# EAGLE schematic Gamebadge3_revB (EAGLE 8.7.1)
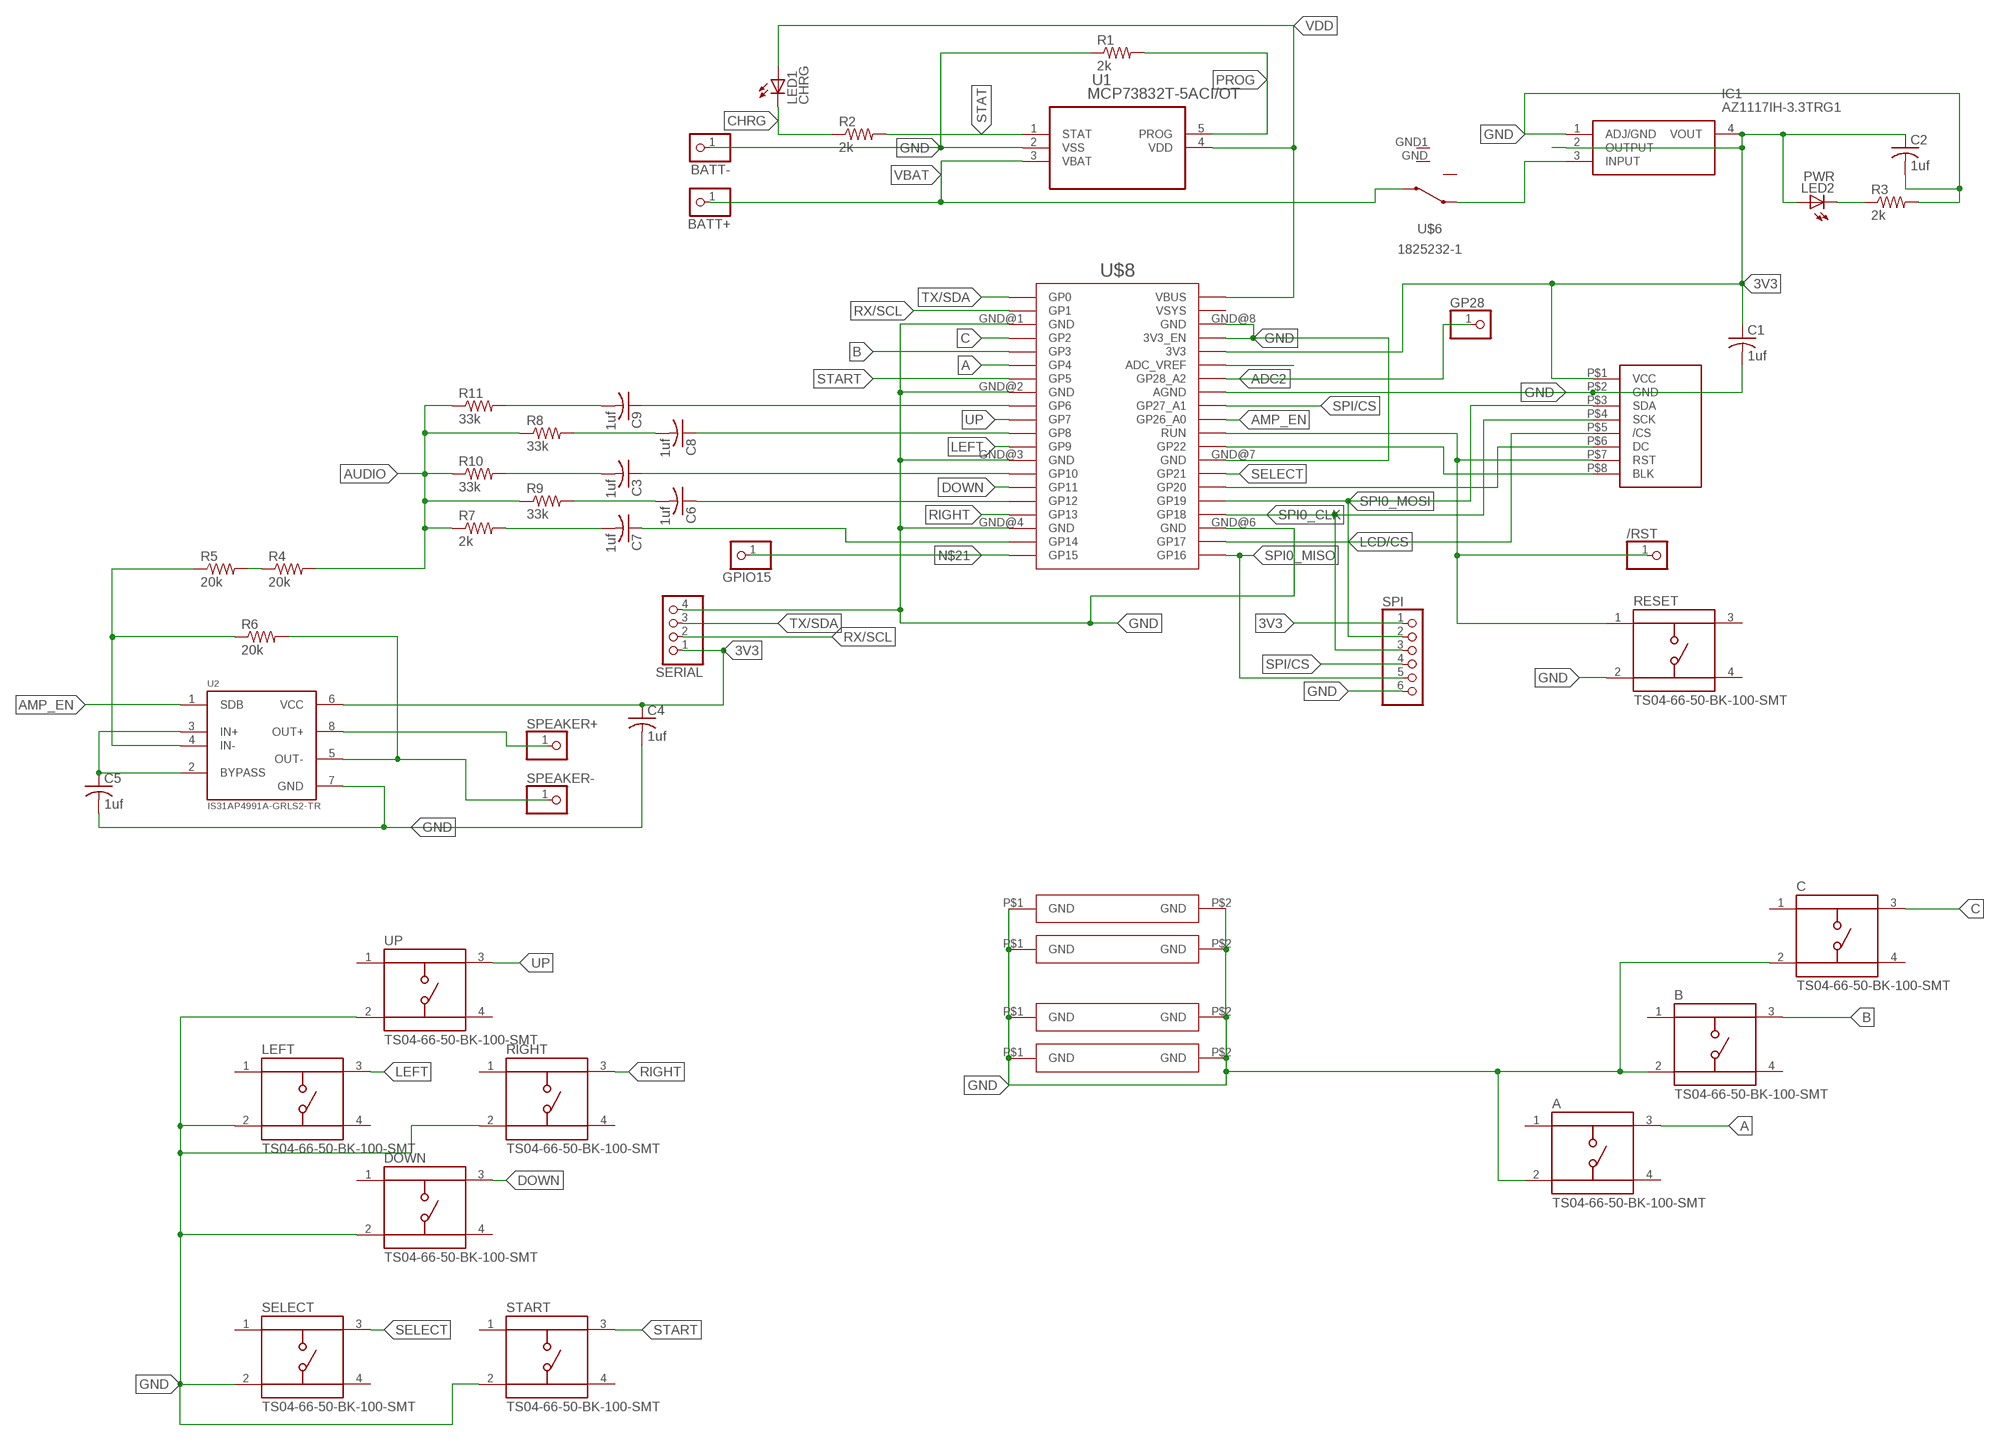
[diagram p0: schematic, sheet 1]

## Parts
/RST  PINHD-1X1  [1X01]
A  TS04-66-50-BK-100-SMT  [SW_TS04-66-50-BK-100-SMT]
B  TS04-66-50-BK-100-SMT  [SW_TS04-66-50-BK-100-SMT]
BATT+  PINHD-1X1  [1X01]
BATT-  PINHD-1X1  [1X01]
C  TS04-66-50-BK-100-SMT  [SW_TS04-66-50-BK-100-SMT]
C1  1uf  C-USC0805  [C0805]
C2  1uf  C-USC0805  [C0805]
C3  1uf  C-USC0805  [C0805]
C4  1uf  C-USC0805  [C0805]
C5  1uf  C-USC0805  [C0805]
C6  1uf  C-USC0805  [C0805]
C7  1uf  C-USC0805  [C0805]
C8  1uf  C-USC0805  [C0805]
C9  1uf  C-USC0805  [C0805]
DOWN  TS04-66-50-BK-100-SMT  [SW_TS04-66-50-BK-100-SMT]
GP28  PINHD-1X1  [1X01]
GPIO15  PINHD-1X1  [1X01]
IC1  AZ1117IH-3.3TRG1  [SOT230P700X170-4N]
LED1  CHRG  LED3MM  [LED3MM]
LED2  PWR  LED3MM  [LED3MM]
LEFT  TS04-66-50-BK-100-SMT  [SW_TS04-66-50-BK-100-SMT]
R1  2k  R-US_R0805  [R0805]
R2  2k  R-US_R0805  [R0805]
R3  2k  R-US_R0805  [R0805]
R4  20k  R-US_R0805  [R0805]
R5  20k  R-US_R0805  [R0805]
R6  20k  R-US_R0805  [R0805]
R7  2k  R-US_R0805  [R0805]
R8  33k  R-US_R0805  [R0805]
R9  33k  R-US_R0805  [R0805]
R10  33k  R-US_R0805  [R0805]
R11  33k  R-US_R0805  [R0805]
RESET  TS04-66-50-BK-100-SMT  [SW_TS04-66-50-BK-100-SMT]
RIGHT  TS04-66-50-BK-100-SMT  [SW_TS04-66-50-BK-100-SMT]
SELECT  TS04-66-50-BK-100-SMT  [SW_TS04-66-50-BK-100-SMT]
SERIAL  PINHD-1X4  [1X04]
SPEAKER+  PINHD-1X1  [1X01]
SPEAKER-  PINHD-1X1  [1X01]
SPI  PINHD-1X6  [1X06]
START  TS04-66-50-BK-100-SMT  [SW_TS04-66-50-BK-100-SMT]
U1  MCP73832T-5ACI/OT  [SOT95P300X145-5N]
U2  IS31AP4991A-GRLS2-TR  [SOIC127P604X170-8N]
U$2  GND_CLIP  [GND_CLIP]
U$3  GND_CLIP  [GND_CLIP]
U$4  GND_CLIP  [GND_CLIP]
U$5  GND_CLIP  [GND_CLIP]
U$6  1825232-1  [1825232-1]
U$7  ST7789_CS  [ST7789_WAVE]
U$8  RPI_PICO_W  [RPI_PICO_W]
UP  TS04-66-50-BK-100-SMT  [SW_TS04-66-50-BK-100-SMT]

## Nets
3V3: C1.1 C2.1 C4.1 IC1.2(OUTPUT) IC1.4(VOUT) LED2.A SERIAL.1 SPI.1 U2.6(VCC) U$7.P$1(VCC) U$8.3V3
A: A.3 U$8.GP4
ADC2: GP28.1 U$8.GP28_A2
AMP_EN: U2.1(SDB) U$8.GP26_A0
AUDIO: R4.2 R7.1 R8.1 R9.1 R10.1 R11.1
B: B.3 U$8.GP3
C: C.3 U$8.GP2
CHRG: LED1.K(C) R2.1
DOWN: DOWN.3 U$8.GP11
GND: A.2 B.2 BATT-.1 C1.2 C2.2 C4.2 C5.2 C.2 DOWN.2 IC1.1(ADJ/GND) LEFT.2 R1.1 R3.2 RESET.2 RIGHT.2 SELECT.2 SERIAL.4 SPI.6 START.2 U1.2(VSS) U2.7(GND) U$2.P$1(GND) U$2.P$2(GND) U$3.P$1(GND) U$3.P$2(GND) U$4.P$1(GND) U$4.P$2(GND) U$5.P$1(GND) U$5.P$2(GND) U$7.P$2(GND) U$8.3V3_EN U$8.AGND U$8.GND@1(GND) U$8.GND@2(GND) U$8.GND@3(GND) U$8.GND@4(GND) U$8.GND@6(GND) U$8.GND@7(GND) U$8.GND@8(GND) UP.2
LCD/CS: U$7.P$5(/CS) U$8.GP17
LEFT: LEFT.3 U$8.GP9
N$1: C5.1 U2.2(BYPASS) U2.3(IN+)
N$2: /RST.1 RESET.1 U$7.P$7(RST) U$8.RUN
N$3: U$7.P$6(DC) U$8.GP20
N$4: R4.1 R5.2
N$5: U$7.P$8(BLK) U$8.GP22
N$6: R5.1 R6.1 U2.4(IN-)
N$7: IC1.3(INPUT) U$6.3
N$8: R6.2 SPEAKER-.1 U2.5(OUT-)
N$9: LED2.K(C) R3.1
N$10: SPEAKER+.1 U2.8(OUT+)
N$11: C6.1 U$8.GP12
N$12: C7.1 U$8.GP14
N$13: C3.1 U$8.GP10
N$14: C6.2 R9.2
N$15: C7.2 R7.2
N$16: C8.1 U$8.GP8
N$17: C8.2 R8.2
N$18: C3.2 R10.2
N$20: U$8.ADC_VREF
N$21: GPIO15.1 U$8.GP15
N$22: C9.1 U$8.GP6
N$23: C9.2 R11.2
PROG: R1.2 U1.5(PROG)
RIGHT: RIGHT.3 U$8.GP13
RX/SCL: SERIAL.2 U$8.GP1
SELECT: SELECT.3 U$8.GP21
SPI0_CLK: SPI.3 U$7.P$4(SCK) U$8.GP18
SPI0_MISO: SPI.5 U$8.GP16
SPI0_MOSI: SPI.2 U$7.P$3(SDA) U$8.GP19
SPI/CS: SPI.4 U$8.GP27_A1
START: START.3 U$8.GP5
STAT: R2.2 U1.1(STAT)
TX/SDA: SERIAL.3 U$8.GP0
UP: U$8.GP7 UP.3
VBAT: BATT+.1 U1.3(VBAT) U$6.2
VDD: LED1.A U1.4(VDD) U$8.VBUS
Unconnected: A.1 A.4 B.1 B.4 C.1 C.4 DOWN.1 DOWN.4 LEFT.1 LEFT.4 RESET.3 RESET.4 RIGHT.1 RIGHT.4 SELECT.1 SELECT.4 START.1 START.4 U$6.1 U$6.GND U$6.GND1 U$8.VSYS UP.1 UP.4

## Library data of the parts
/RST BATT+ BATT- GP28 GPIO15 SPEAKER+ SPEAKER- = adafruit:PINHD-1X1: Pin header 1x1 for 0.1" spacing With round pins
A B C DOWN LEFT RESET RIGHT SELECT START UP = TS04-66-50-BK-100-SMT:TS04-66-50-BK-100-SMT: Check availability <https://pricing.snapeda.com/parts/TS04-66-50-BK-100-SMT/CUI%20Devices/view-part?ref=eda>; AVAILABILITY: In Stock; CUI_PURCHASE_URL: https://www.cuidevices.com/product/switches/tactile-switches/ts04-series?utm_source=snapeda.com&utm_medium=referral&utm_campaign=snapedaBOM; DESCRIPTION: 6 x 6 mm, 4.3~9.5 mm Actuator Height, 100~260 gf, Surface Mount, SPST, Tactile Switch; MF: CUI Devices; MP: TS04-66-50-BK-100-SMT; PACKAGE: None; PRICE: None; PURCHASE-URL: https://pricing.snapeda.com/search/part/TS04-66-50-BK-100-SMT/?ref=eda
C1-C9 = adafruit:C-US: CAPACITOR, American symbol
IC1 = AZ1117IH-3.3TRG1:AZ1117IH-3.3TRG1: LDO Voltage Regulators LDO BJT HiCurr 1.35A 10Hz to 10KHz Source: Datasheet Check availability <https://pricing.snapeda.com/parts/AZ1117IH-3.3TRG1/Diodes%20Inc./view-part?ref=eda>; AVAILABILITY: In Stock; DESCRIPTION: Linear Voltage Regulator IC Positive Fixed 1 Output 1A SOT-223-3; MF: Diodes Inc.; MP: AZ1117IH-3.3TRG1; PACKAGE: SOT-223 Diodes Inc.; PRICE: None; PURCHASE-URL: https://pricing.snapeda.com/search/part/AZ1117IH-3.3TRG1/?ref=eda
LED1 LED2 = adafruit:LED: LED OSRAM: - CHIPLED LG R971, LG N971, LY N971, LG Q971, LY Q971, LO R971, LY R971 LH N974, LH R974 LS Q976, LO Q976, LY Q976 LO Q996 - Hyper CHIPLED LW Q18S LB Q993, LB Q99A, LB R99A - SideLED LS A670, LO A670, LY A670, LG A670, LP A670 LB A673, LV A673, LT A673, LW A673 LH A674 LY A675 LS A676, LA A676, LO A676, LY A676, LW A676 LS A679, LY A679, LG A679 - Hyper Micro SIDELED® LS Y876, LA Y876, LO Y876, LY Y876 LT Y87S - SmartLED LW L88C, LW L88S LB L89C, LB L89S, LG L890 LS L89K, LO L89K, LY L89K LS L896, LA L896, LO L896, LY L896 - TOPLED LS T670, LO T670, LY T670, LG T670, LP T670 LSG T670, LSP T670, LSY T670, LOP T670, LYG T670 LG T671, LOG T671, LSG T671 LB T673, LV T673, LT T673, LW T673 LH T674 LS T676, LA T676, LO T676, LY T676, LB T676, LH T676, LSB T676, LW T676 LB T67C, LV T67C, LT T67C, LS T67K, LO T67K, LY T67K, LW E67C LS E67B, LA E67B, LO E67B, LY E67B, LB E67C, LV E67C, LT E67C LW T67C LS T679, LY T679, LG T679 LS T770, LO T770, LY T770, LG T770, LP T770 LB T773, LV T773, LT T773, LW T773 LH T774 LS E675, LA E675, LY E675, LS T675 LS T776, LA T776, LO T776, LY T776, LB T776 LHGB T686 LT T68C, LB T68C - Hyper Mini TOPLED® LB M676 - Mini TOPLED Santana® LG M470 LS M47K, LO M47K, LY M47K Source: http://www.osram.convergy.de/
R1-R11 = resistor:R-US_: RESISTOR, American symbol
SERIAL = pinhead:PINHD-1X4: PIN HEADER
SPI = adafruit:PINHD-1X6: PIN HEADER
U1 = MCP73832T-5ACI_OT:MCP73832T-5ACI/OT: IC, BATT CHARGER, Li-Ion Li-Polymer, 500 mA Check availability <https://pricing.snapeda.com/parts/MCP73832T-5ACI/OT/Microchip/view-part?ref=eda>; AVAILABILITY: In Stock; DESCRIPTION: Charger IC Lithium Ion/Polymer SOT-23-5; MF: Microchip; MP: MCP73832T-5ACI/OT; PACKAGE: SOT-23 Microchip; PRICE: None; PURCHASE-URL: https://pricing.snapeda.com/search/part/MCP73832T-5ACI/OT/?ref=eda
U2 = IS31AP4991A-GRLS2-TR:IS31AP4991A-GRLS2-TR: Ic Audio Pwr Amp 1.1w 8soic Check availability <https://pricing.snapeda.com/parts/IS31AP4991A-GRLS2-TR/Lumissil%20Microsystems/view-part?ref=eda>; AVAILABILITY: In Stock; DESCRIPTION: Audio Amp Speaker 1-CH Mono 1.4W Class-AB 8-Pin SOP T/R; MF: Lumissil Microsystems; MP: IS31AP4991A-GRLS2-TR; PACKAGE: None; PRICE: None; PURCHASE-URL: https://pricing.snapeda.com/search/part/IS31AP4991A-GRLS2-TR/?ref=eda
U$2-U$5 = MGC 2023:GND_CLIP
U$6 = switch 1825232-1:1825232-1: Check prices <https://pricing.snapeda.com/parts/1825232-1/TE%20Connectivity/view-part?ref=eda>; AVAILABILITY: In Stock; COMMENT: 1825232-1; DESCRIPTION: Switch Slide ON None ON SPDT Side Slide 0.2A 30VDC 10000Cycle PC Pins Bracket Mount/Through Hole; EU_ROHS_COMPLIANCE: Compliant; MF: TE Connectivity; MP: 1825232-1; PACKAGE: None; PRICE: None; PURCHASE-URL: https://pricing.snapeda.com/search/part/1825232-1/?ref=eda
U$7 = MGC 2023:ST7789_CS
U$8 = RaspberryPi_Pico W:RPI_PICO_W